# EAGLE schematic main_board (EAGLE 8.0.0)

## Sheet 1 of 3
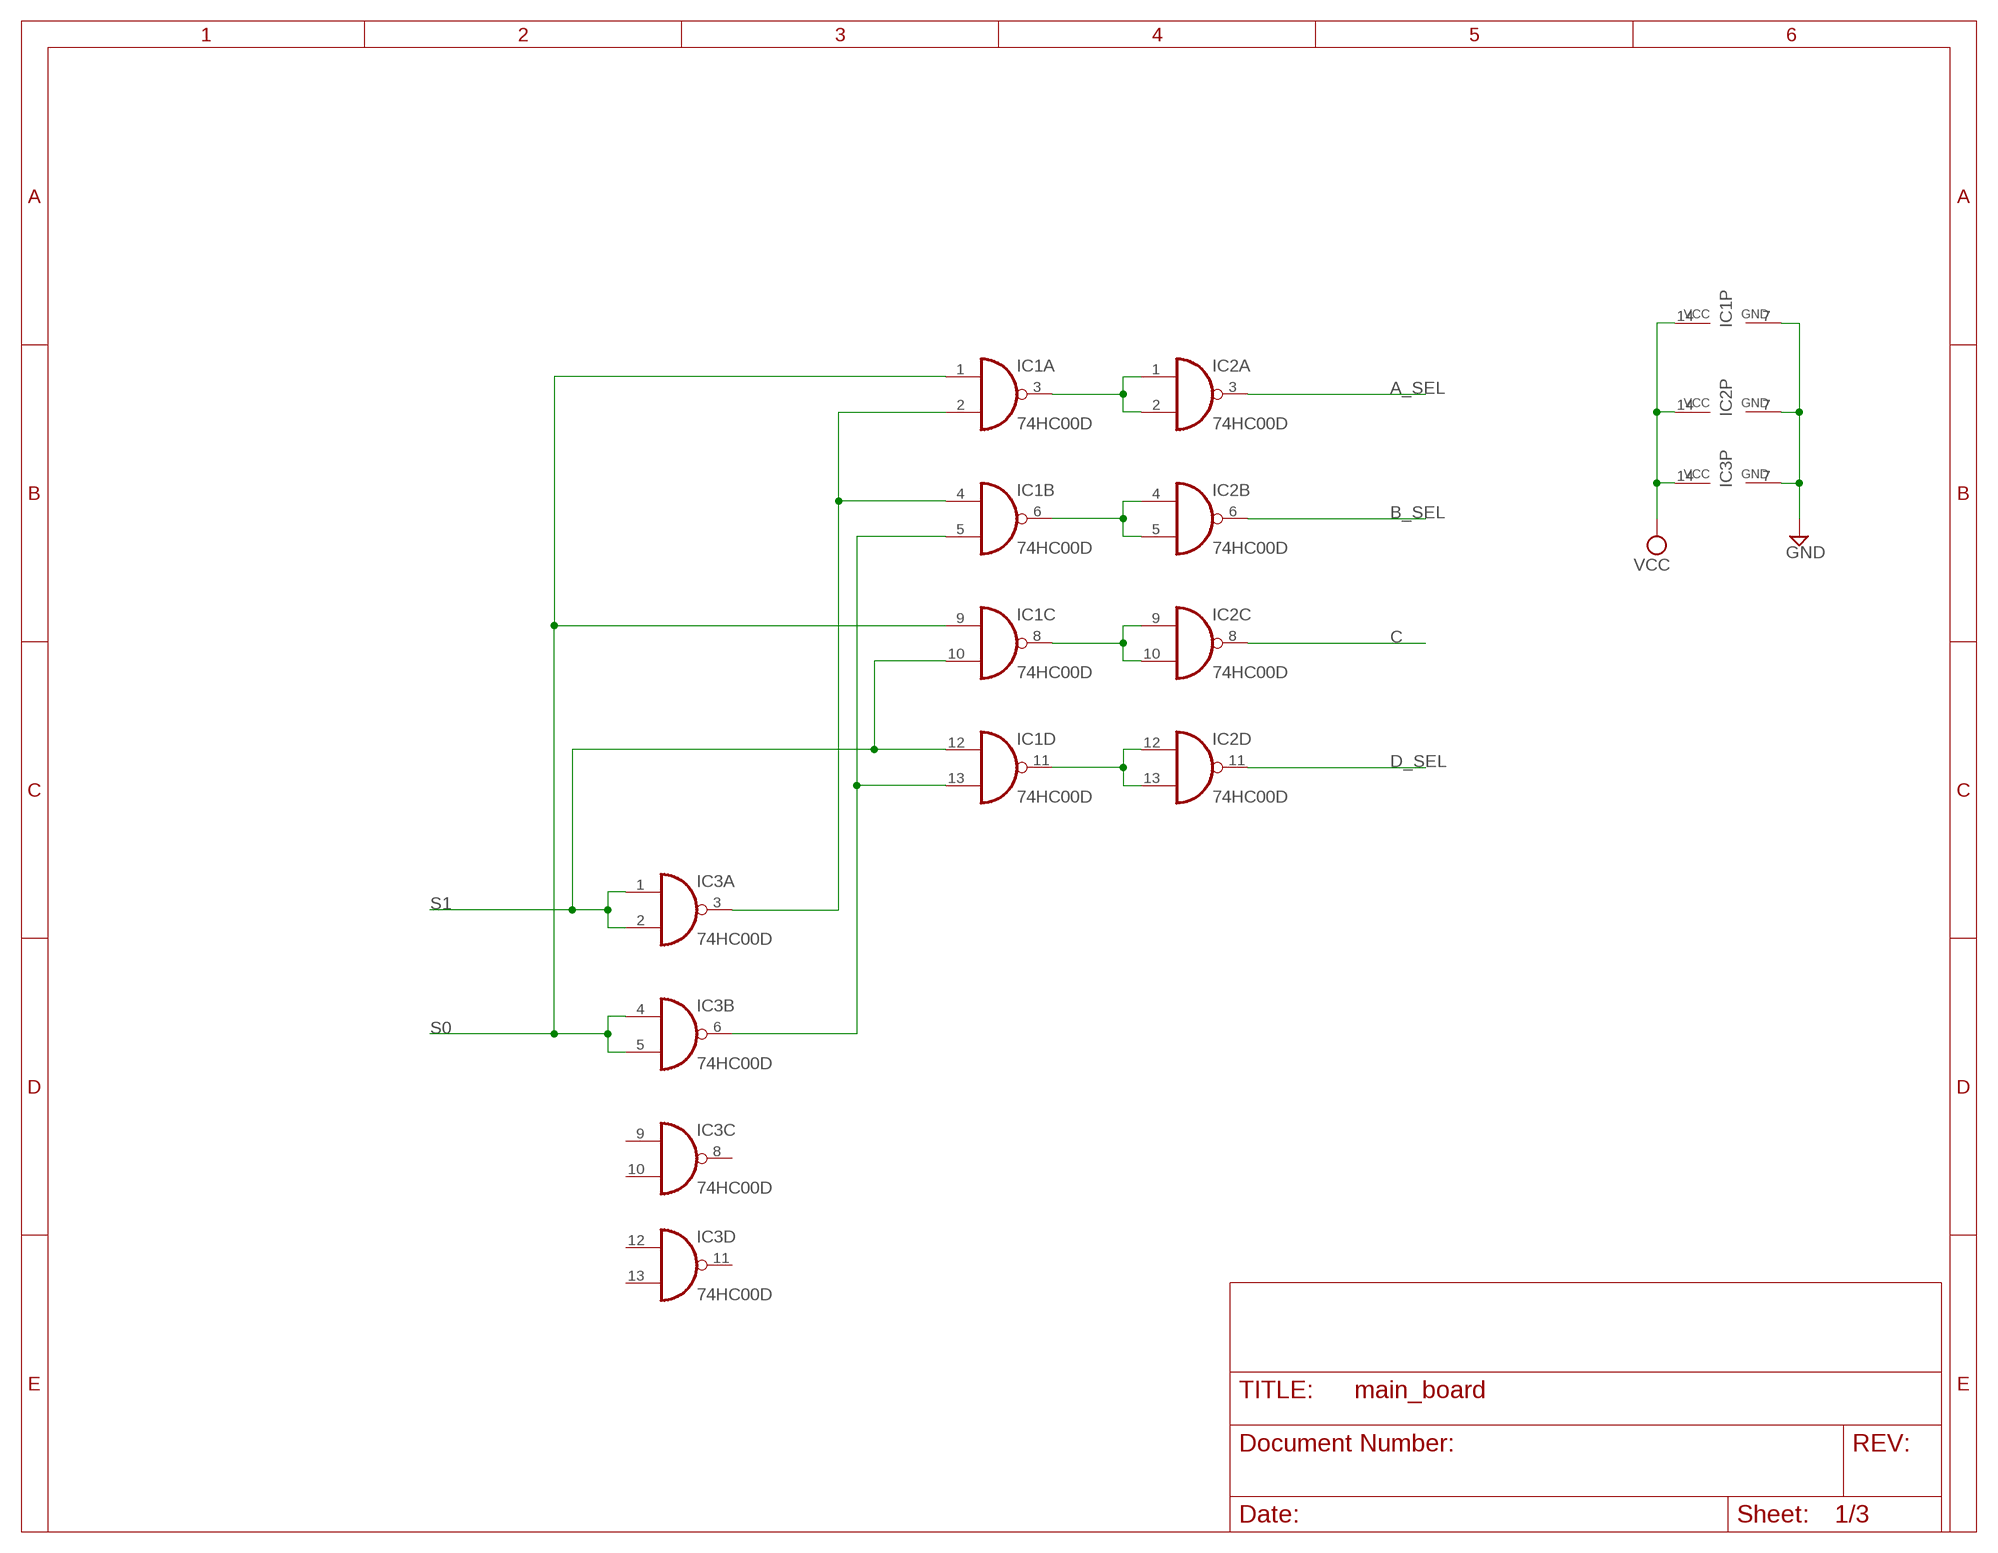
[diagram p0: schematic, sheet 1]

### Parts
IC1  74HC00D  [SO14]
IC2  74HC00D  [SO14]
IC3  74HC00D  [SO14]

### Nets
A_SEL: IC2.3(A:O) ; also sheet 2,3
B_SEL: IC2.6(B:O) ; also sheet 2,3
C: IC2.8(C:O) ; also sheet 2,3
D_SEL: IC2.11(D:O) ; also sheet 2,3
GND: IC1.7(P:GND) IC2.7(P:GND) IC3.7(P:GND) ; also sheet 2,3
N$1: IC1.11(D:O) IC2.12(D:I0) IC2.13(D:I1)
N$2: IC1.8(C:O) IC2.9(C:I0) IC2.10(C:I1)
N$3: IC1.6(B:O) IC2.4(B:I0) IC2.5(B:I1)
N$4: IC1.3(A:O) IC2.1(A:I0) IC2.2(A:I1)
N$7: IC1.5(B:I1) IC1.13(D:I1) IC3.6(B:O)
N$8: IC1.2(A:I1) IC1.4(B:I0) IC3.3(A:O)
S0: IC1.1(A:I0) IC1.9(C:I0) IC3.4(B:I0) IC3.5(B:I1)
S1: IC1.10(C:I1) IC1.12(D:I0) IC3.1(A:I0) IC3.2(A:I1)
VCC: IC1.14(P:VCC) IC2.14(P:VCC) IC3.14(P:VCC) ; also sheet 2,3
Unconnected: IC3.8(C:O) IC3.9(C:I0) IC3.10(C:I1) IC3.11(D:O) IC3.12(D:I0) IC3.13(D:I1)

## Sheet 2 of 3: Selectors 0-3
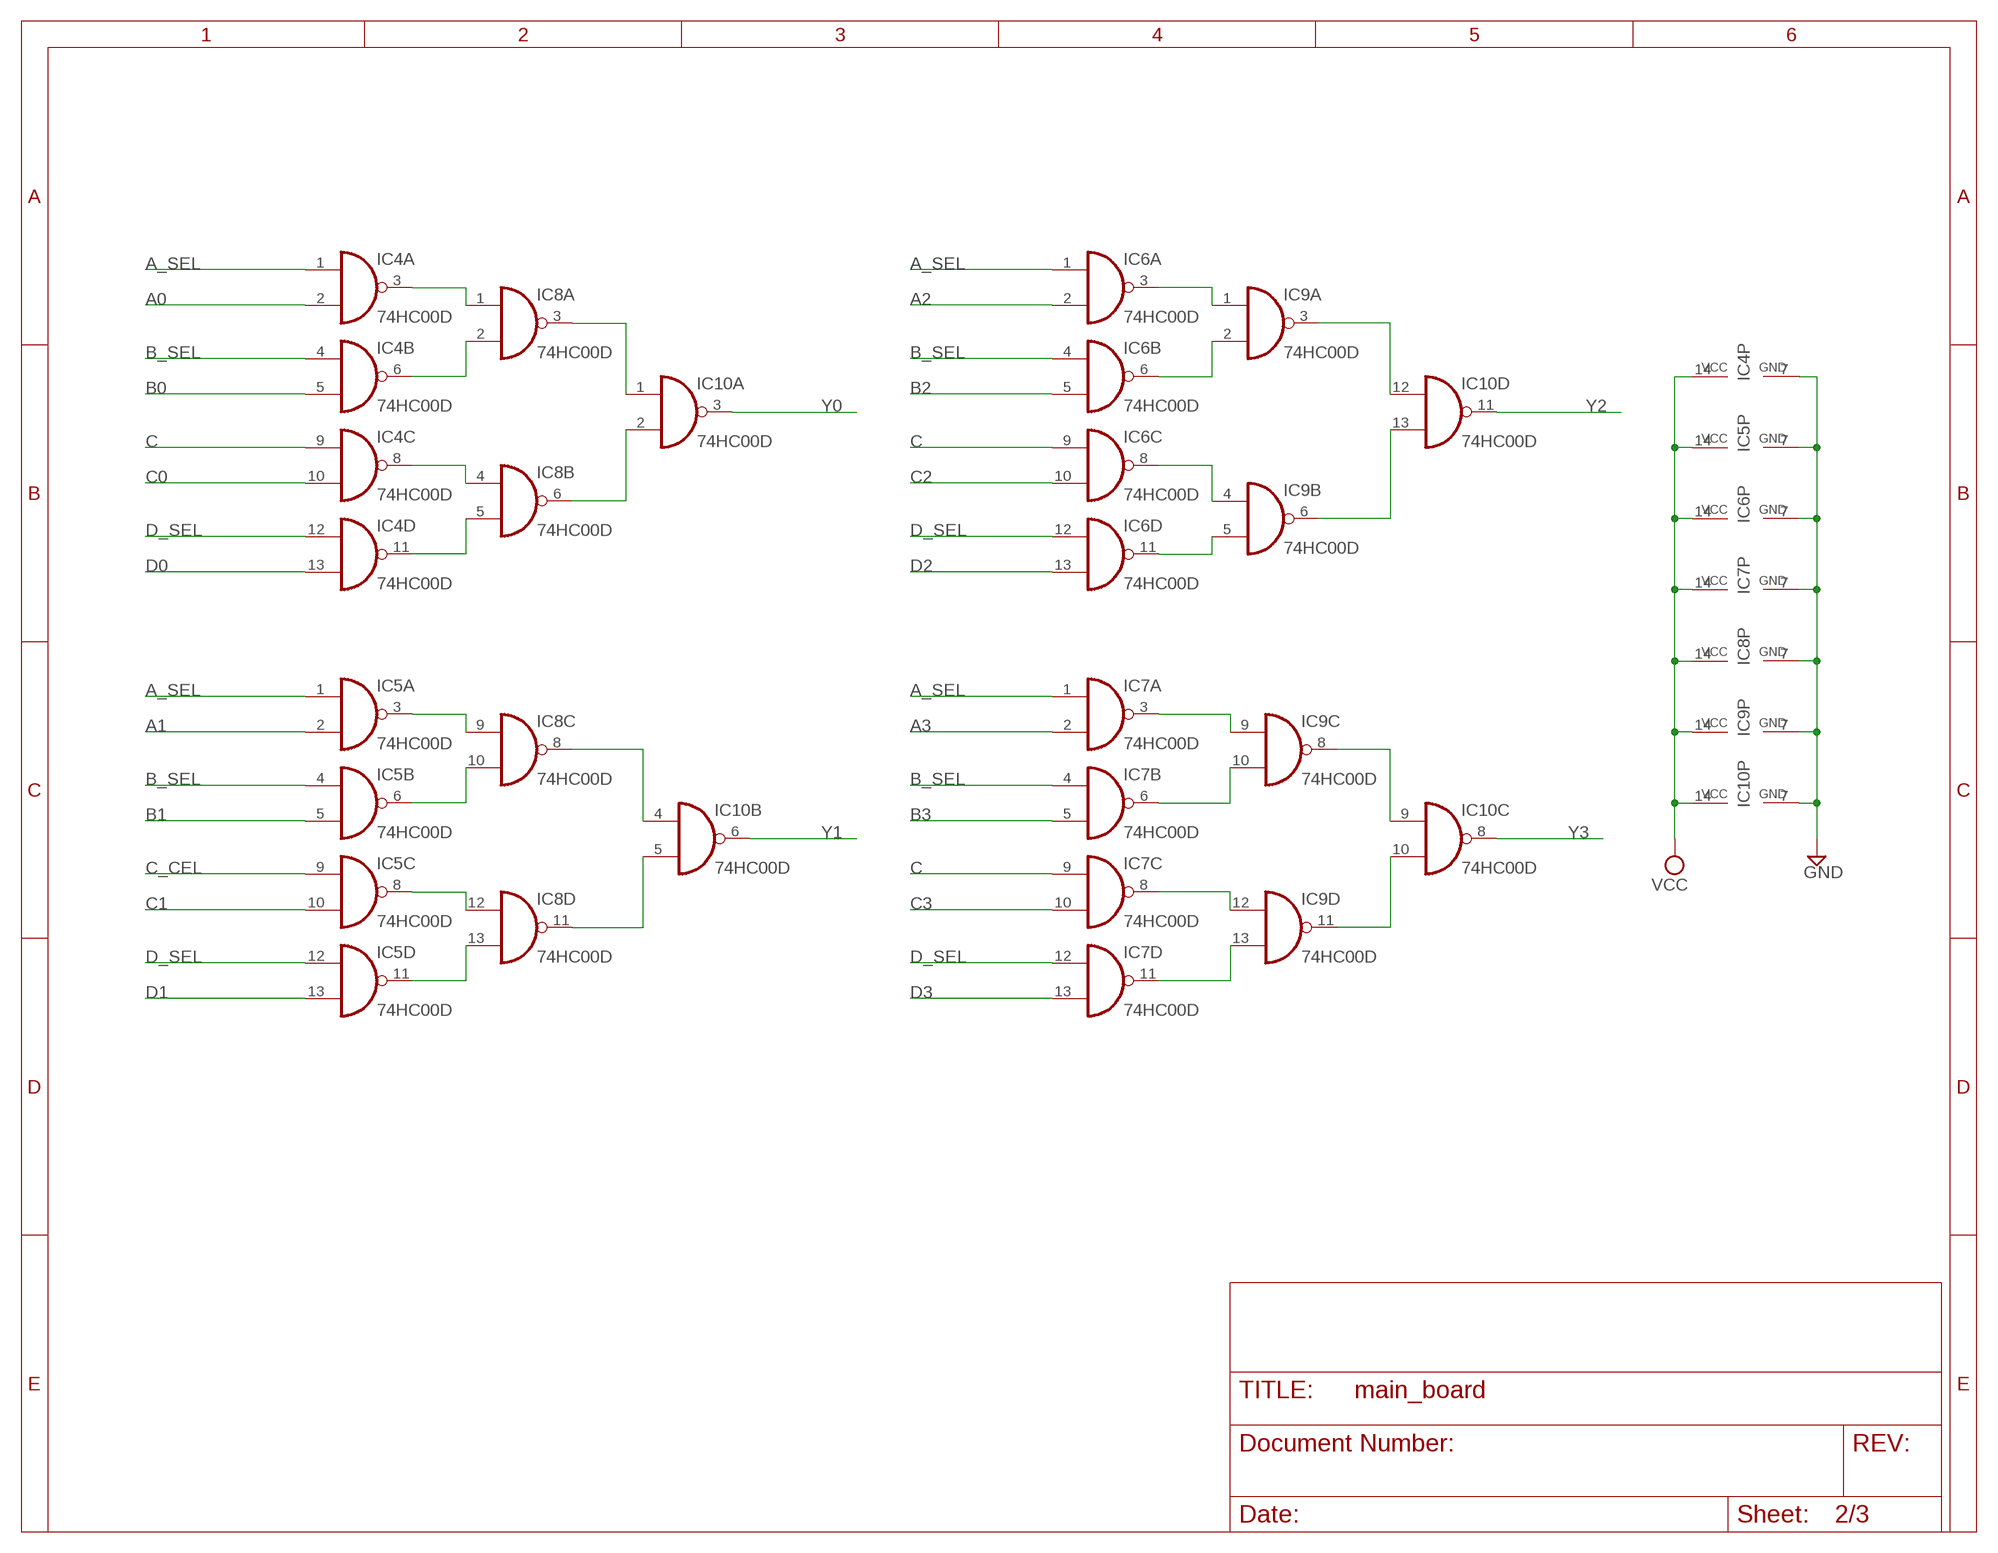
[diagram p1: schematic, sheet 2]

### Parts
IC4  74HC00D  [SO14]
IC5  74HC00D  [SO14]
IC6  74HC00D  [SO14]
IC7  74HC00D  [SO14]
IC8  74HC00D  [SO14]
IC9  74HC00D  [SO14]
IC10  74HC00D  [SO14]

### Nets
A0: IC4.2(A:I1)
A1: IC5.2(A:I1)
A2: IC6.2(A:I1)
A3: IC7.2(A:I1)
A_SEL: IC4.1(A:I0) IC5.1(A:I0) IC6.1(A:I0) IC7.1(A:I0) ; also sheet 1,3
B0: IC4.5(B:I1)
B1: IC5.5(B:I1)
B2: IC6.5(B:I1)
B3: IC7.5(B:I1)
B_SEL: IC4.4(B:I0) IC5.4(B:I0) IC6.4(B:I0) IC7.4(B:I0) ; also sheet 1,3
C: IC4.9(C:I0) IC6.9(C:I0) IC7.9(C:I0) ; also sheet 1,3
C0: IC4.10(C:I1)
C1: IC5.10(C:I1)
C2: IC6.10(C:I1)
C3: IC7.10(C:I1)
C_CEL: IC5.9(C:I0) ; also sheet 3
D0: IC4.13(D:I1)
D1: IC5.13(D:I1)
D2: IC6.13(D:I1)
D3: IC7.13(D:I1)
D_SEL: IC4.12(D:I0) IC5.12(D:I0) IC6.12(D:I0) IC7.12(D:I0) ; also sheet 1,3
GND: IC4.7(P:GND) IC5.7(P:GND) IC6.7(P:GND) IC7.7(P:GND) IC8.7(P:GND) IC9.7(P:GND) IC10.7(P:GND) ; also sheet 1,3
N$15: IC4.3(A:O) IC8.1(A:I0)
N$16: IC4.6(B:O) IC8.2(A:I1)
N$17: IC8.3(A:O) IC10.1(A:I0)
N$18: IC8.6(B:O) IC10.2(A:I1)
N$19: IC4.8(C:O) IC8.4(B:I0)
N$20: IC4.11(D:O) IC8.5(B:I1)
N$21: IC5.3(A:O) IC8.9(C:I0)
N$22: IC5.6(B:O) IC8.10(C:I1)
N$23: IC5.8(C:O) IC8.12(D:I0)
N$24: IC5.11(D:O) IC8.13(D:I1)
N$25: IC8.11(D:O) IC10.5(B:I1)
N$26: IC8.8(C:O) IC10.4(B:I0)
N$27: IC9.8(C:O) IC10.9(C:I0)
N$28: IC9.11(D:O) IC10.10(C:I1)
N$29: IC7.11(D:O) IC9.13(D:I1)
N$30: IC7.8(C:O) IC9.12(D:I0)
N$31: IC7.6(B:O) IC9.10(C:I1)
N$32: IC7.3(A:O) IC9.9(C:I0)
N$33: IC6.11(D:O) IC9.5(B:I1)
N$34: IC6.6(B:O) IC9.2(A:I1)
N$35: IC9.6(B:O) IC10.13(D:I1)
N$36: IC6.8(C:O) IC9.4(B:I0)
N$37: IC6.3(A:O) IC9.1(A:I0)
N$38: IC9.3(A:O) IC10.12(D:I0)
VCC: IC4.14(P:VCC) IC5.14(P:VCC) IC6.14(P:VCC) IC7.14(P:VCC) IC8.14(P:VCC) IC9.14(P:VCC) IC10.14(P:VCC) ; also sheet 1,3
Y0: IC10.3(A:O)
Y1: IC10.6(B:O)
Y2: IC10.11(D:O)
Y3: IC10.8(C:O)

## Sheet 3 of 3
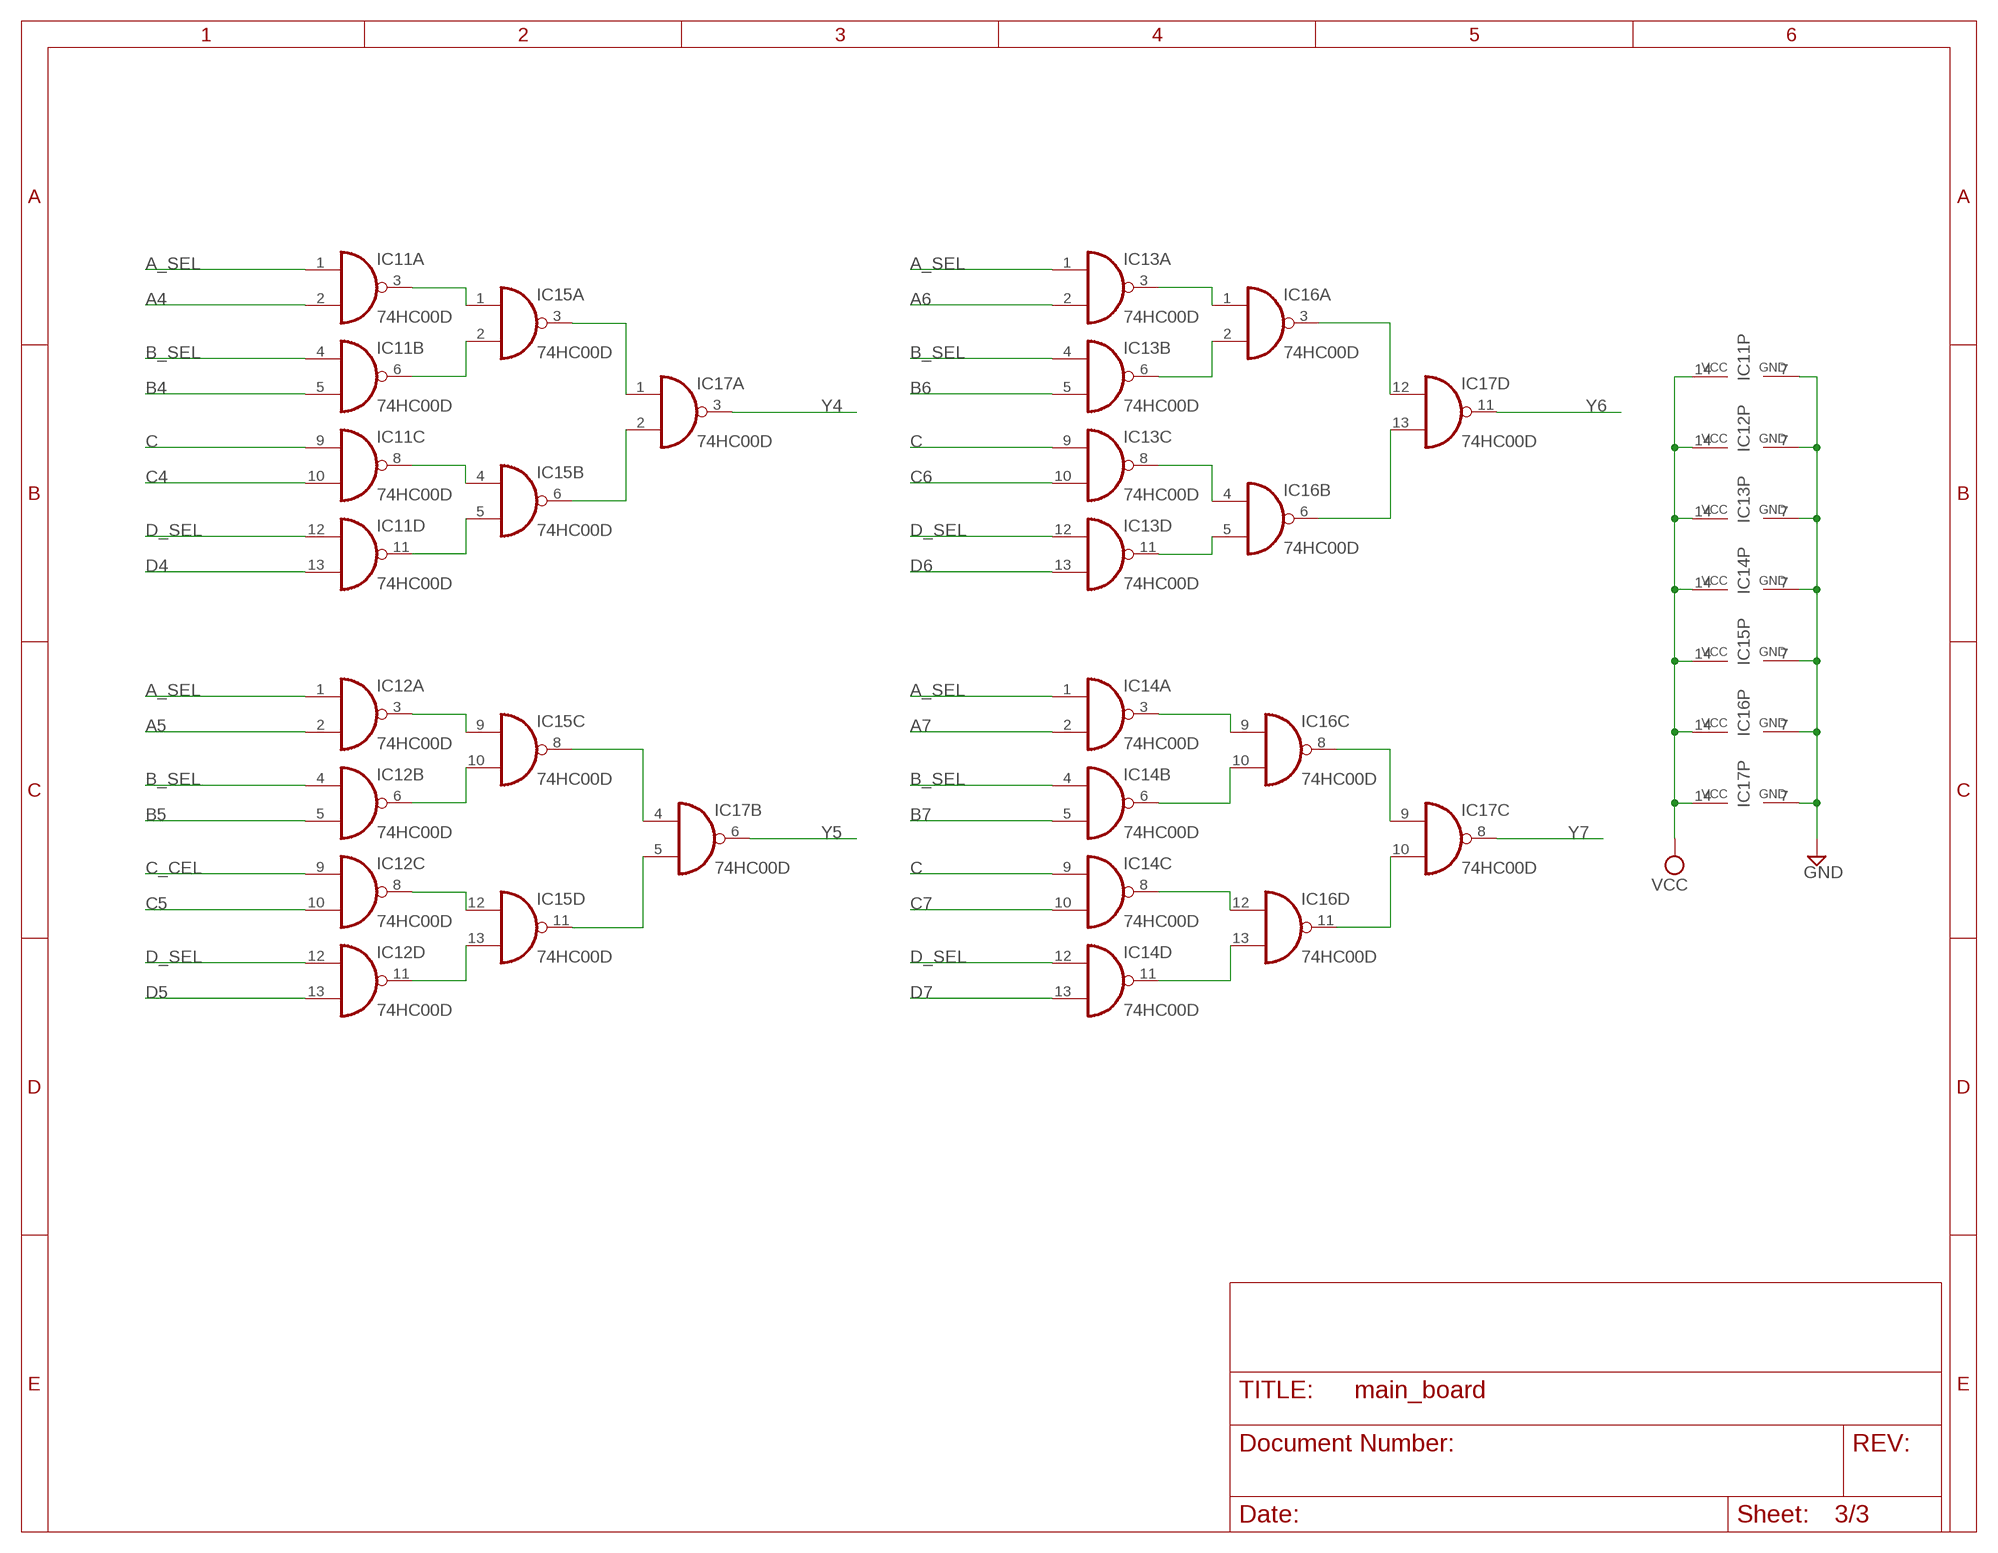
[diagram p2: schematic, sheet 3]

### Parts
IC11  74HC00D  [SO14]
IC12  74HC00D  [SO14]
IC13  74HC00D  [SO14]
IC14  74HC00D  [SO14]
IC15  74HC00D  [SO14]
IC16  74HC00D  [SO14]
IC17  74HC00D  [SO14]

### Nets
A4: IC11.2(A:I1)
A5: IC12.2(A:I1)
A6: IC13.2(A:I1)
A7: IC14.2(A:I1)
A_SEL: IC11.1(A:I0) IC12.1(A:I0) IC13.1(A:I0) IC14.1(A:I0) ; also sheet 1,2
B4: IC11.5(B:I1)
B5: IC12.5(B:I1)
B6: IC13.5(B:I1)
B7: IC14.5(B:I1)
B_SEL: IC11.4(B:I0) IC12.4(B:I0) IC13.4(B:I0) IC14.4(B:I0) ; also sheet 1,2
C: IC11.9(C:I0) IC13.9(C:I0) IC14.9(C:I0) ; also sheet 1,2
C4: IC11.10(C:I1)
C5: IC12.10(C:I1)
C6: IC13.10(C:I1)
C7: IC14.10(C:I1)
C_CEL: IC12.9(C:I0) ; also sheet 2
D4: IC11.13(D:I1)
D5: IC12.13(D:I1)
D6: IC13.13(D:I1)
D7: IC14.13(D:I1)
D_SEL: IC11.12(D:I0) IC12.12(D:I0) IC13.12(D:I0) IC14.12(D:I0) ; also sheet 1,2
GND: IC11.7(P:GND) IC12.7(P:GND) IC13.7(P:GND) IC14.7(P:GND) IC15.7(P:GND) IC16.7(P:GND) IC17.7(P:GND) ; also sheet 1,2
N$5: IC11.3(A:O) IC15.1(A:I0)
N$6: IC11.6(B:O) IC15.2(A:I1)
N$9: IC15.3(A:O) IC17.1(A:I0)
N$10: IC15.6(B:O) IC17.2(A:I1)
N$11: IC11.8(C:O) IC15.4(B:I0)
N$12: IC11.11(D:O) IC15.5(B:I1)
N$39: IC12.3(A:O) IC15.9(C:I0)
N$40: IC12.6(B:O) IC15.10(C:I1)
N$41: IC12.8(C:O) IC15.12(D:I0)
N$42: IC12.11(D:O) IC15.13(D:I1)
N$43: IC15.11(D:O) IC17.5(B:I1)
N$44: IC15.8(C:O) IC17.4(B:I0)
N$45: IC16.8(C:O) IC17.9(C:I0)
N$46: IC16.11(D:O) IC17.10(C:I1)
N$47: IC14.11(D:O) IC16.13(D:I1)
N$48: IC14.8(C:O) IC16.12(D:I0)
N$49: IC14.6(B:O) IC16.10(C:I1)
N$50: IC14.3(A:O) IC16.9(C:I0)
N$51: IC13.11(D:O) IC16.5(B:I1)
N$52: IC13.6(B:O) IC16.2(A:I1)
N$53: IC16.6(B:O) IC17.13(D:I1)
N$54: IC13.8(C:O) IC16.4(B:I0)
N$55: IC13.3(A:O) IC16.1(A:I0)
N$56: IC16.3(A:O) IC17.12(D:I0)
VCC: IC11.14(P:VCC) IC12.14(P:VCC) IC13.14(P:VCC) IC14.14(P:VCC) IC15.14(P:VCC) IC16.14(P:VCC) IC17.14(P:VCC) ; also sheet 1,2
Y4: IC17.3(A:O)
Y5: IC17.6(B:O)
Y6: IC17.11(D:O)
Y7: IC17.8(C:O)

## Library data of the parts
IC1-IC17 = 74HC00:74*00: Quad 2-input NAND gate